# EAGLE board CFT-PB0-revF (EAGLE 5.11), part 1 of 2
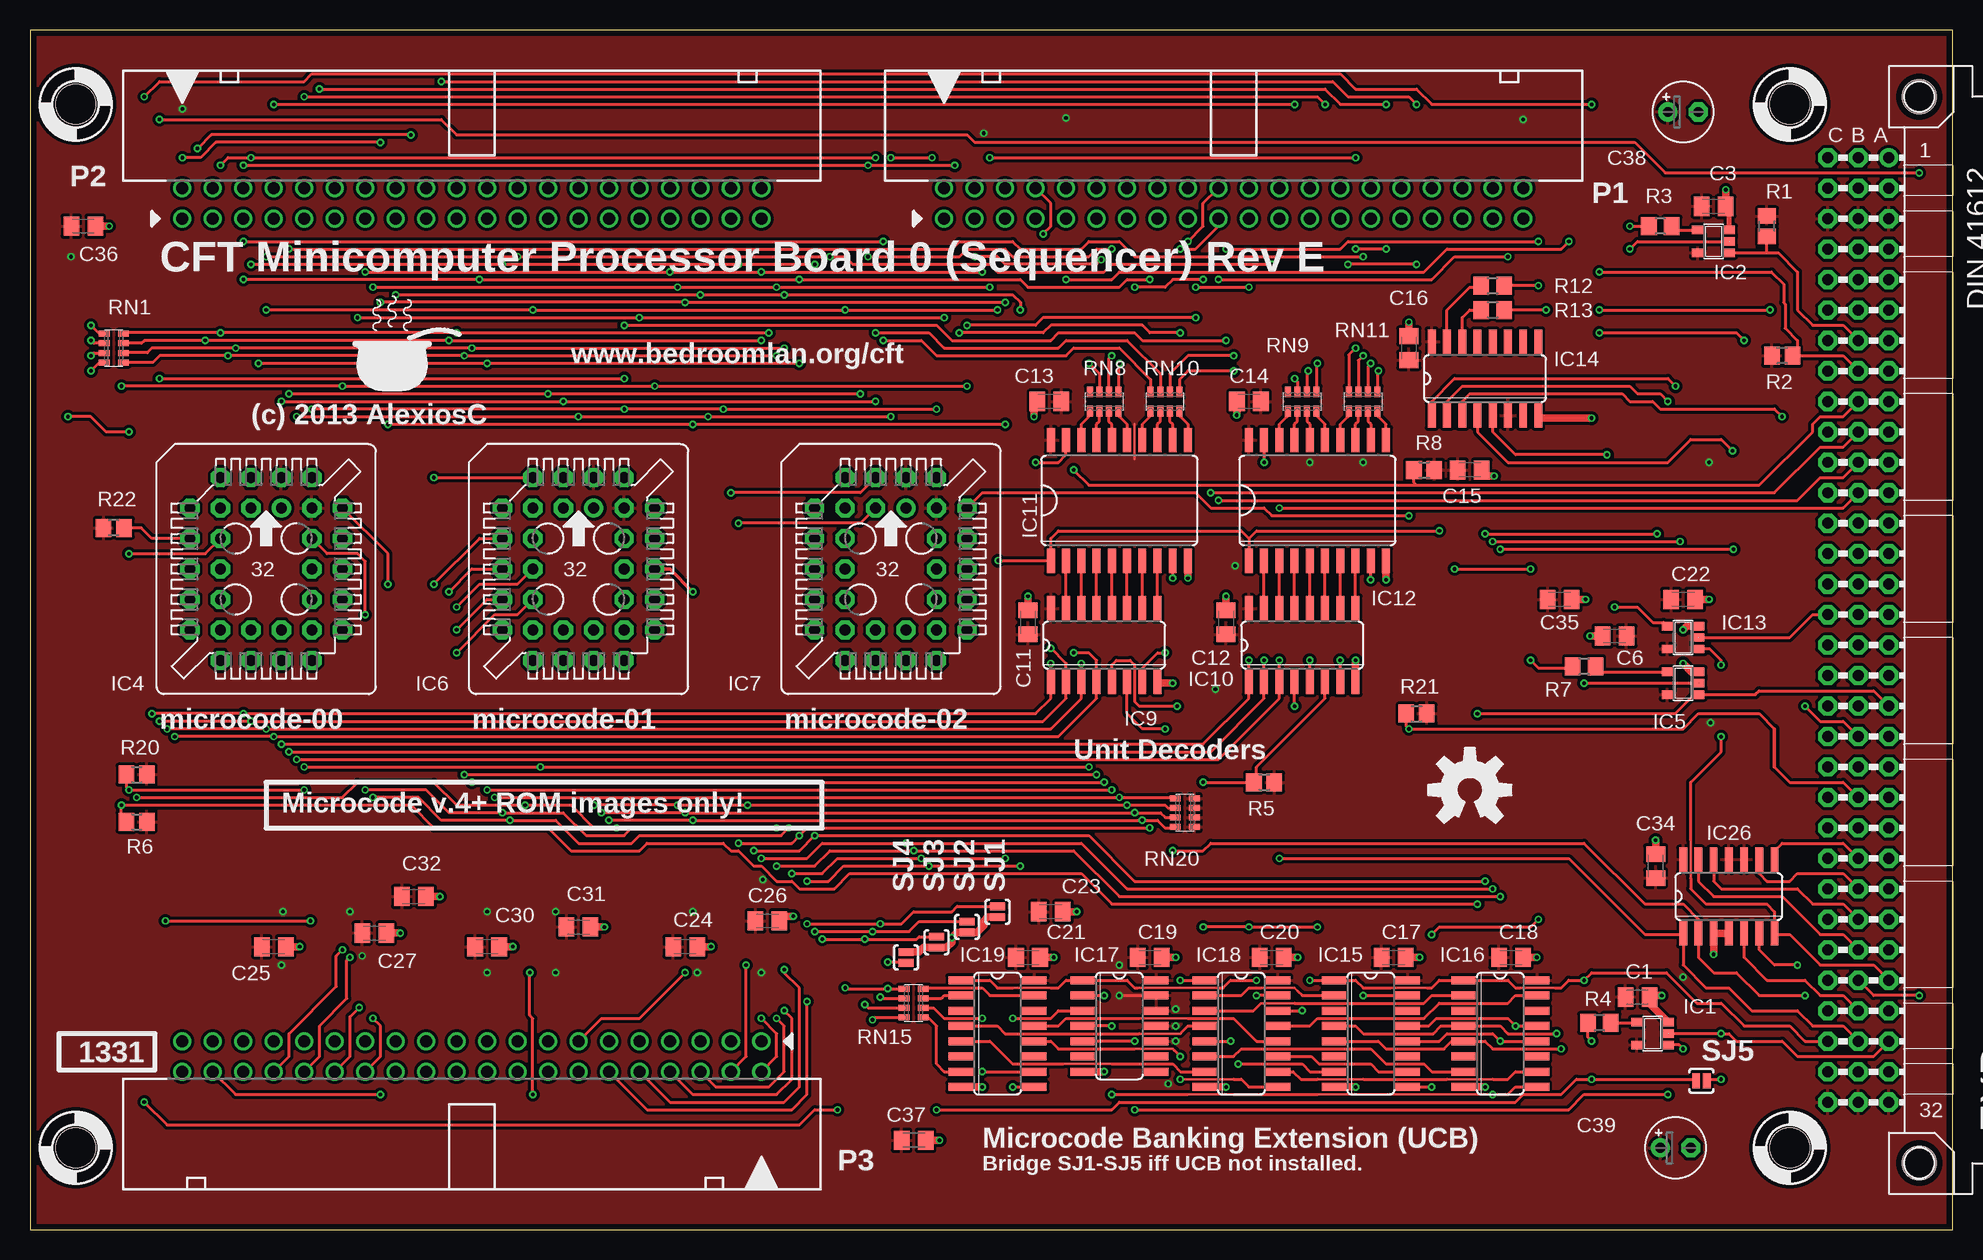
[diagram p6: board, top side]
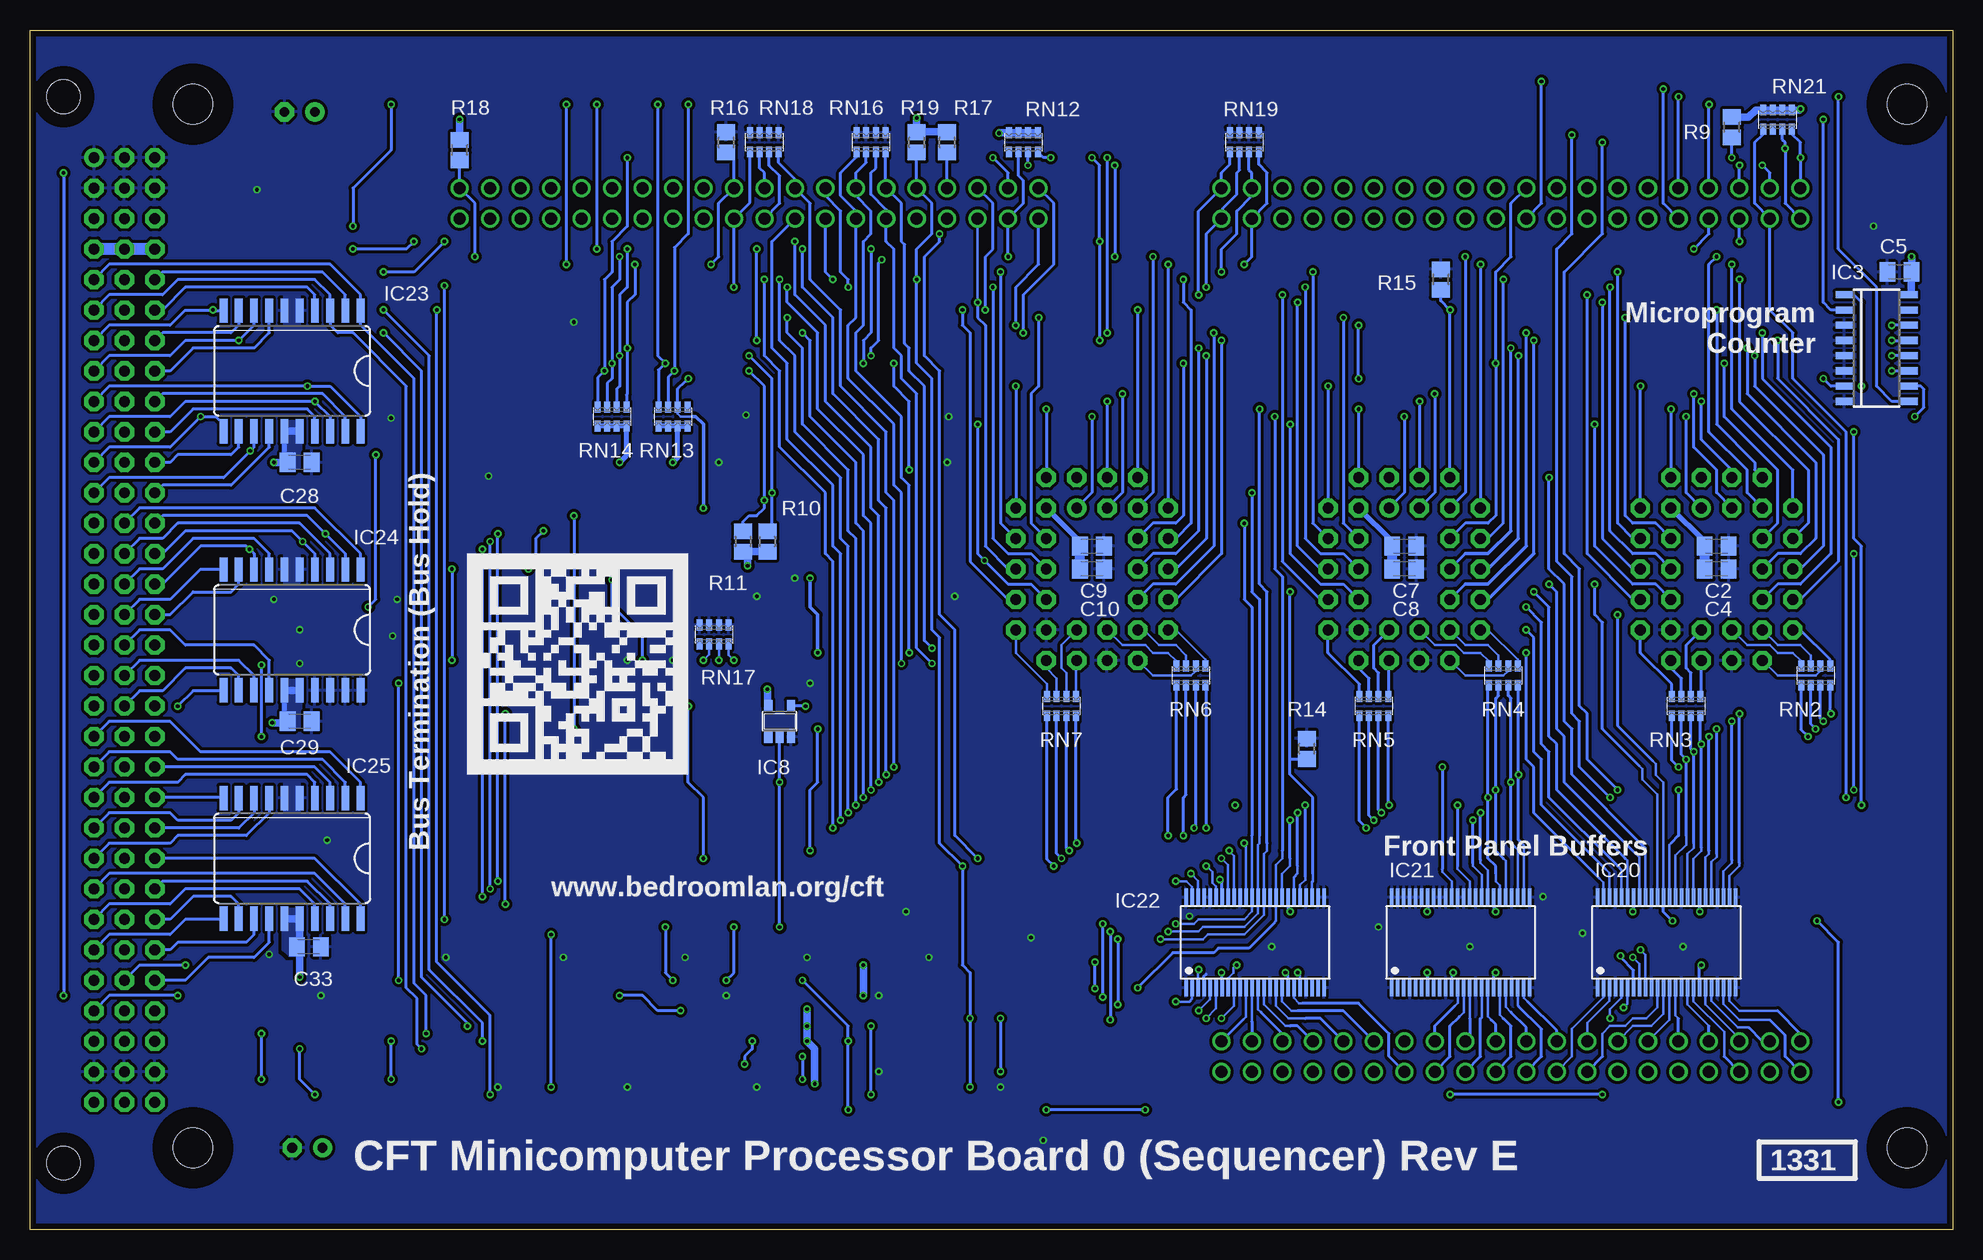
[diagram p7: board, bottom side, seen from below]

Size 160.27 x 100.03 mm. Coordinates in mm from the lower left corner, seen from the top.
Copper layers (1*16): Top 0.035mm / dielectric 1.5mm / Bottom 0.035mm
Design rules "smart-prototyping *": minimum track width 7mil, minimum drill 12mil, track to track 7mil, track to pad 7mil, pad to pad 7mil, via to via 7mil, smd to smd 0mil, copper to edge 20mil, drill to drill 10mil, minimum pad ring 10mil, minimum via ring 6mil, stop-mask expansion 2mil, vias tented up to drill 25mil, thermal gap 10mil
Net classes: 0 default: width 0.203 mm, clearance 0.152 mm; 1 low power: width 0.203 mm, clearance 0.152 mm; 2 power rail: width 0.61 mm, clearance 0.203 mm

## Footprints (pad centres in the part's own frame; a part is rotated, then mirrored left to right if it is on the bottom)
C0805K = smd 1.3 x 1.6: 1 -1,0; 2 1,0
E2,5-5 = drill 0.813 pad 1.6 round: + -1.27,0 | drill 0.813 pad 1.6 octagon: - 1.27,0
VG96K = drill 0.914 pad 1.6 round: A1 154.94,39.37 | drill 0.914 pad 1.6 octagon: A2 154.94,36.83; A3 154.94,34.29; A4 154.94,31.75; A5 154.94,29.21; A6 154.94,26.67; A7 154.94,24.13; A8 154.94,21.59; A9 154.94,19.05; A10 154.94,16.51; A11 154.94,13.97; A12 154.94,11.43; A13 154.94,8.89; A14 154.94,6.35; A15 154.94,3.81; A16 154.94,1.27; A17 154.94,-1.27; A18 154.94,-3.81; A19 154.94,-6.35; A20 154.94,-8.89; A21 154.94,-11.43; A22 154.94,-13.97; A23 154.94,-16.51; A24 154.94,-19.05; A25 154.94,-21.59; A26 154.94,-24.13; A27 154.94,-26.67; A28 154.94,-29.21; A29 154.94,-31.75; A30 154.94,-34.29; A31 154.94,-36.83; A32 154.94,-39.37; B1 152.4,39.37; B2 152.4,36.83; B3 152.4,34.29; B4 152.4,31.75; B5 152.4,29.21; B6 152.4,26.67; B7 152.4,24.13; B8 152.4,21.59; B9 152.4,19.05; B10 152.4,16.51; B11 152.4,13.97; B12 152.4,11.43; B13 152.4,8.89; B14 152.4,6.35; B15 152.4,3.81; B16 152.4,1.27; B17 152.4,-1.27; B18 152.4,-3.81; B19 152.4,-6.35; B20 152.4,-8.89; B21 152.4,-11.43; B22 152.4,-13.97; B23 152.4,-16.51; B24 152.4,-19.05; B25 152.4,-21.59; B26 152.4,-24.13; B27 152.4,-26.67; B28 152.4,-29.21; B29 152.4,-31.75; B30 152.4,-34.29; B31 152.4,-36.83; B32 152.4,-39.37; C1 149.86,39.37; C2 149.86,36.83; C3 149.86,34.29; C4 149.86,31.75; C5 149.86,29.21; C6 149.86,26.67; C7 149.86,24.13; C8 149.86,21.59; C9 149.86,19.05; C10 149.86,16.51; C11 149.86,13.97; C12 149.86,11.43; C13 149.86,8.89; C14 149.86,6.35; C15 149.86,3.81; C16 149.86,1.27; C17 149.86,-1.27; C18 149.86,-3.81; C19 149.86,-6.35; C20 149.86,-8.89; C21 149.86,-11.43; C22 149.86,-13.97; C23 149.86,-16.51; C24 149.86,-19.05; C25 149.86,-21.59; C26 149.86,-24.13; C27 149.86,-26.67; C28 149.86,-29.21; C29 149.86,-31.75; C30 149.86,-34.29; C31 149.86,-36.83; C32 149.86,-39.37 | hole 2.794: 157.48,44.45; 157.48,-44.45
SOT23-5 = smd 0.69 x 0.99: 1 -0.95,-1.29; 2 0,-1.29; 3 0.95,-1.29; 4 0.95,1.3; 5 -0.95,1.3
SO16D = smd 0.6 x 1.4: 1 -4.445,-2.715; 2 -3.175,-2.715; 3 -1.905,-2.715; 4 -0.635,-2.715; 5 0.635,-2.715; 6 1.905,-2.715; 7 3.175,-2.715; 8 4.445,-2.715; 9 4.445,2.715; 10 3.175,2.715; 11 1.905,2.715; 12 0.635,2.715; 13 -0.635,2.715; 14 -1.905,2.715; 15 -3.175,2.715; 16 -4.445,2.715
PLCC32 = drill 0.9 pad 1.6 round: 1 1.27,5.08 | drill 0.9 pad 1.6 octagon: 2 -1.27,7.62; 3 -1.27,5.08; 4 -3.81,7.62; 5 -6.35,5.08; 6 -3.81,5.08; 7 -6.35,2.54; 8 -3.81,2.54; 9 -6.35,0; 10 -3.81,0; 11 -6.35,-2.54; 12 -3.81,-2.54; 13 -6.35,-5.08; 14 -3.81,-7.62; 15 -3.81,-5.08; 16 -1.27,-7.62; 17 -1.27,-5.08; 18 1.27,-7.62; 19 1.27,-5.08; 20 3.81,-7.62; 21 6.35,-5.08; 22 3.81,-5.08; 23 6.35,-2.54; 24 3.81,-2.54; 25 6.35,0; 26 3.81,0; 27 6.35,2.54; 28 3.81,2.54; 29 6.35,5.08; 30 3.81,7.62; 31 3.81,5.08; 32 1.27,7.62
SO16 = smd 0.66 x 2.032: 1 -4.445,-3.073; 2 -3.175,-3.073; 3 -1.905,-3.073; 4 -0.635,-3.073; 5 0.635,-3.073; 6 1.905,-3.073; 7 3.175,-3.073; 8 4.445,-3.073; 9 4.445,3.073; 10 3.175,3.073; 11 1.905,3.073; 12 0.635,3.073; 13 -0.635,3.073; 14 -1.905,3.073; 15 -3.175,3.073; 16 -4.445,3.073
SO20W = smd 0.66 x 2.032: 1 -5.715,-5.029; 2 -4.445,-5.029; 3 -3.175,-5.029; 4 -1.905,-5.029; 5 -0.635,-5.029; 6 0.635,-5.029; 7 1.905,-5.029; 8 3.175,-5.029; 9 4.445,-5.029; 10 5.715,-5.029; 11 5.715,5.029; 12 4.445,5.029; 13 3.175,5.029; 14 1.905,5.029; 15 0.635,5.029; 16 -0.635,5.029; 17 -1.905,5.029; 18 -3.175,5.029; 19 -4.445,5.029; 20 -5.715,5.029
SO14 = smd 0.66 x 2.032: 1 -3.81,-3.073; 2 -2.54,-3.073; 3 -1.27,-3.073; 4 0,-3.073; 5 1.27,-3.073; 6 2.54,-3.073; 7 3.81,-3.073; 8 3.81,3.073; 9 2.54,3.073; 10 1.27,3.073; 11 0,3.073; 12 -1.27,3.073; 13 -2.54,3.073; 14 -3.81,3.073
TSSOP-48 = smd 0.28 x 1.43: 1 -5.49,-3.794; 2 -4.99,-3.794; 3 -4.49,-3.794; 4 -3.99,-3.794; 5 -3.49,-3.794; 6 -2.99,-3.794; 7 -2.49,-3.794; 8 -1.99,-3.794; 9 -1.49,-3.794; 10 -0.99,-3.794; 11 -0.49,-3.794; 12 0.01,-3.794; 13 0.51,-3.794; 14 1.01,-3.794; 15 1.51,-3.794; 16 2.01,-3.794; 17 2.51,-3.794; 18 3.01,-3.794; 19 3.51,-3.794; 20 4.01,-3.794; 21 4.51,-3.794; 22 5.01,-3.794; 23 5.51,-3.794; 24 6.01,-3.794; 25 6.01,3.756; 26 5.51,3.756; 27 5.01,3.756; 28 4.51,3.756; 29 4.01,3.756; 30 3.51,3.756; 31 3.01,3.756; 32 2.51,3.756; 33 2.01,3.756; 34 1.51,3.756; 35 1.01,3.756; 36 0.51,3.756; 37 0.01,3.756; 38 -0.49,3.756; 39 -0.99,3.756; 40 -1.49,3.756; 41 -1.99,3.756; 42 -2.49,3.756; 43 -2.99,3.756; 44 -3.49,3.756; 45 -3.99,3.756; 46 -4.49,3.756; 47 -4.99,3.756; 48 -5.49,3.756
PAK100/2500-5-40 = drill 1 pad 1.422 round: 1 -24.13,-1.27; 2 -24.13,1.27; 3 -21.59,-1.27; 4 -21.59,1.27; 5 -19.05,-1.27; 6 -19.05,1.27; 7 -16.51,-1.27; 8 -16.51,1.27; 9 -13.97,-1.27; 10 -13.97,1.27; 11 -11.43,-1.27; 12 -11.43,1.27; 13 -8.89,-1.27; 14 -8.89,1.27; 15 -6.35,-1.27; 16 -6.35,1.27; 17 -3.81,-1.27; 18 -3.81,1.27; 19 -1.27,-1.27; 20 -1.27,1.27; 21 1.27,-1.27; 22 1.27,1.27; 23 3.81,-1.27; 24 3.81,1.27; 25 6.35,-1.27; 26 6.35,1.27; 27 8.89,-1.27; 28 8.89,1.27; 29 11.43,-1.27; 30 11.43,1.27; 31 13.97,-1.27; 32 13.97,1.27; 33 16.51,-1.27; 34 16.51,1.27; 35 19.05,-1.27; 36 19.05,1.27; 37 21.59,-1.27; 38 21.59,1.27; 39 24.13,-1.27; 40 24.13,1.27
R0805 = smd 1.3 x 1.5: 1 -0.85,0; 2 0.85,0
R0805' = smd 1.3 x 1.5: 1 -0.95,0; 2 0.95,0
CTS742C083 = smd 0.5 x 0.9: 1 -1.2,-0.8; 2 -0.4,-0.8; 3 0.4,-0.8; 4 1.2,-0.8; 5 1.2,0.8; 6 0.4,0.8; 7 -0.4,0.8; 8 -1.2,0.8
SJ_2S-NO = smd 0.635 x 1.27: 1 -0.45,0; 2 0.45,0
STANDOFF_28_60 = hole 3.302: 0,0

## Placement (x,y rotation side)
$4_37_$  SIGNATURESILK  [SIGNATURE]  27.3,69.7 0 top
$4_39_$  OSHW-LOGOL  [OSHW-LOGO-L]  120.02,36.68 0 top
$4_40_$  QRCODE-CFT  [CFT-QRCODE]  123.83,37.95 0 bottom
C1  0.1uF  [C0805K]  133.99,19.41 0 top
C2  0.1uF  [C0805K]  19.68,57 0 bottom
C3  0.1uF  [C0805K]  140.34,85.32 0 top
C4  1uF  [C0805K]  19.68,55.09 0 bottom
C5  0.1uF  [C0805K]  4.45,79.86 180 bottom
C6  0.1uF  [C0805K]  132.08,49.5 180 top
C7  0.1uF  [C0805K]  45.72,57 0 bottom
C8  1uF  [C0805K]  45.72,55.09 0 bottom
C9  0.1uF  [C0805K]  71.75,57 0 bottom
C10  1uF  [C0805K]  71.75,55.09 0 bottom
C11  0.1uF  [C0805K]  83.19,50.65 270 top
C12  0.1uF  [C0805K]  99.69,50.65 270 top
C13  0.1uF  [C0805K]  84.96,69.06 0 top
C14  0.1uF  [C0805K]  101.6,69.06 0 top
C15  1uF  [C0805K]  120.02,63.35 180 top
C16  0.1uF  [C0805K]  114.94,73.51 90 top
C17  0.1uF  [C0805K]  113.67,22.71 0 top
C18  0.1uF  [C0805K]  123.44,22.71 0 top
C19  0.1uF  [C0805K]  93.34,22.71 0 top
C20  0.1uF  [C0805K]  103.5,22.71 0 top
C21  0.1uF  [C0805K]  83.19,22.71 0 top
C22  0.1uF  [C0805K]  137.79,52.55 0 top
C23  1uF  [C0805K]  85.09,26.52 0 top
C24  0.1uF  [C0805K]  54.61,23.6 0 top
C25  0.1uF  [C0805K]  20.32,23.6 0 top
C26  0.1uF  [C0805K]  61.47,25.76 0 top
C27  0.1uF  [C0805K]  28.7,24.74 0 top
C28  0.1uF  [C0805K]  137.79,63.98 0 bottom
C29  0.1uF  [C0805K]  137.79,42.39 0 bottom
C30  0.1uF  [C0805K]  38.1,23.6 0 top
C31  0.1uF  [C0805K]  45.72,25.25 0 top
C32  1uF  [C0805K]  32,27.79 0 top
C33  0.1uF  [C0805K]  137.03,23.6 0 bottom
C34  0.1uF  [C0805K]  135.51,30.33 90 top
C35  1uF  [C0805K]  127.51,52.55 0 top
C36  1uF  [C0805K]  4.45,83.67 0 top
C37  1uF  [C0805K]  73.66,7.47 0 top
C38  47uF  [E2,5-5]  137.79,93.19 0 top
C39  47uF  [E2,5-5]  137.16,6.83 0 top
EXP  [VG96K]  0,50.01 0 top
IC1  74AHC1G32DBV  [SOT23-5]  135.25,16.36 90 top
IC2  74AHC1G08DBV  [SOT23-5]  140.34,82.4 90 top
IC3  74HC161D  [SO16D]  6.35,73.51 270 bottom
IC4  29F040  [PLCC32]  19.68,55.09 0 top
IC5  74AHC1G00DBV  [SOT23-5]  137.79,45.57 90 top
IC6  29F040  [PLCC32]  45.72,55.09 0 top
IC7  29F040  [PLCC32]  71.75,55.09 0 top
IC8  74AHC1G04DBV  [SOT23-5]  97.79,42.39 0 bottom
IC9  74HC138D  [SO16]  89.53,48.74 0 top
IC10  74HC138D  [SO16]  106.05,48.74 0 top
IC11  74HC541DW  [SO20W]  90.81,60.81 0 top
IC12  74HC541DW  [SO20W]  107.31,60.81 0 top
IC13  74AHC1G32DBV  [SOT23-5]  137.79,49.38 90 top
IC14  74HC138D  [SO16]  121.28,70.97 0 top
IC15  74HC175D  [SO16]  111.76,16.36 270 top
IC16  74HC175D  [SO16]  122.56,16.36 270 top
IC17  74HC74D  [SO14]  90.81,16.99 270 top
IC18  74HC157D  [SO16]  100.97,16.36 270 top
IC19  74HC175D  [SO16]  80.64,16.36 270 top
IC20  74AC16244DGG  [TSSOP-48]  24.13,23.98 0 bottom
IC21  74AC16244DGG  [TSSOP-48]  41.27,23.98 0 bottom
IC22  74AC16244DGG  [TSSOP-48]  58.42,23.98 0 bottom
IC23  SN74ACT1073  [SO20W]  138.43,71.6 180 bottom
IC24  SN74ACT1073  [SO20W]  138.43,50.01 180 bottom
IC25  SN74ACT1073  [SO20W]  138.43,30.96 180 bottom
IC26  SN74ACT1071D  [SO14]  141.6,27.79 0 top
P1  2540-5  [PAK100/2500-5-40]  100.33,85.57 0 top
P2  2540-5  [PAK100/2500-5-40]  36.83,85.57 0 top
P3  2540-5  [PAK100/2500-5-40]  36.83,14.45 180 top
R1  4k7  [R0805]  144.78,83.67 90 top
R2  4k7  [R0805]  146.05,72.87 180 top
R3  30R  [R0805']  135.89,83.67 180 top
R4  30R  [R0805']  130.81,17.25 180 top
R5  4k7  [R0805]  102.87,37.31 0 top
R6  4k7  [R0805]  8.89,34.01 0 top
R7  30R  [R0805']  129.54,46.96 180 top
R8  4k7  [R0805]  116.2,63.35 0 top
R9  4k7  [R0805]  18.41,91.92 90 bottom
R10  4k7  [R0805]  98.81,57.38 270 bottom
R11  4k7  [R0805]  100.84,57.38 270 bottom
R12  30R  [R0805']  121.92,78.71 0 top
R13  30R  [R0805']  121.92,76.68 0 top
R14  4k7  [R0805]  53.85,40.11 90 bottom
R15  4k7  [R0805]  42.67,79.22 90 bottom
R16  4k7  [R0805]  102.23,90.65 90 bottom
R17  4k7  [R0805]  83.82,90.65 90 bottom
R18  4k7  [R0805]  124.46,90.02 90 bottom
R19  4k7  [R0805]  86.36,90.65 90 bottom
R20  4k7  [R0805]  8.89,37.95 0 top
R21  4k7  [R0805]  115.57,43.03 0 top
R22  4k7  [R0805]  6.99,58.52 180 top
RN1  30R  [CTS742C083]  6.99,73.51 270 top
RN2  30R  [CTS742C083]  11.43,46.2 180 bottom
RN3  30R  [CTS742C083]  22.23,43.66 180 bottom
RN4  30R  [CTS742C083]  37.47,46.2 180 bottom
RN5  30R  [CTS742C083]  48.26,43.66 180 bottom
RN6  30R  [CTS742C083]  63.5,46.2 180 bottom
RN7  30R  [CTS742C083]  74.3,43.66 180 bottom
RN8  30R  [CTS742C083]  89.53,69.06 0 top
RN9  30R  [CTS742C083]  106.05,69.06 0 top
RN10  30R  [CTS742C083]  94.61,69.06 0 top
RN11  30R  [CTS742C083]  111.12,69.06 0 top
RN12  4k7  [CTS742C083]  77.47,90.65 0 bottom
RN13  4k7  [CTS742C083]  106.68,67.79 180 bottom
RN14  4k7  [CTS742C083]  111.76,67.79 180 bottom
RN15  30R  [CTS742C083]  73.66,18.9 90 top
RN16  10k  [CTS742C083]  90.17,90.65 0 bottom
RN17  10k  [CTS742C083]  103.25,49.63 0 bottom
RN18  10k  [CTS742C083]  99.06,90.65 0 bottom
RN19  10k  [CTS742C083]  59.05,90.65 0 bottom
RN20  10k  [CTS742C083]  96.27,34.77 270 top
RN21  10k  [CTS742C083]  14.61,92.56 0 bottom
SJ1  SOLDERJUMPER-OLDNO  [SJ_2S-NO]  80.64,26.52 90 top
SJ2  SOLDERJUMPER-OLDNO  [SJ_2S-NO]  78.11,25.25 90 top
SJ3  SOLDERJUMPER-OLDNO  [SJ_2S-NO]  75.56,23.98 90 top
SJ4  SOLDERJUMPER-OLDNO  [SJ_2S-NO]  73.03,22.71 270 top
SJ5  SOLDERJUMPER-OLDNO  [SJ_2S-NO]  139.32,12.42 0 top
U1  HOLE  [STANDOFF_28_60]  3.81,93.83 0 top
U2  HOLE  [STANDOFF_28_60]  3.81,6.83 0 top
U3  HOLE  [STANDOFF_28_60]  146.69,93.83 0 top
U4  HOLE  [STANDOFF_28_60]  146.69,6.83 0 top